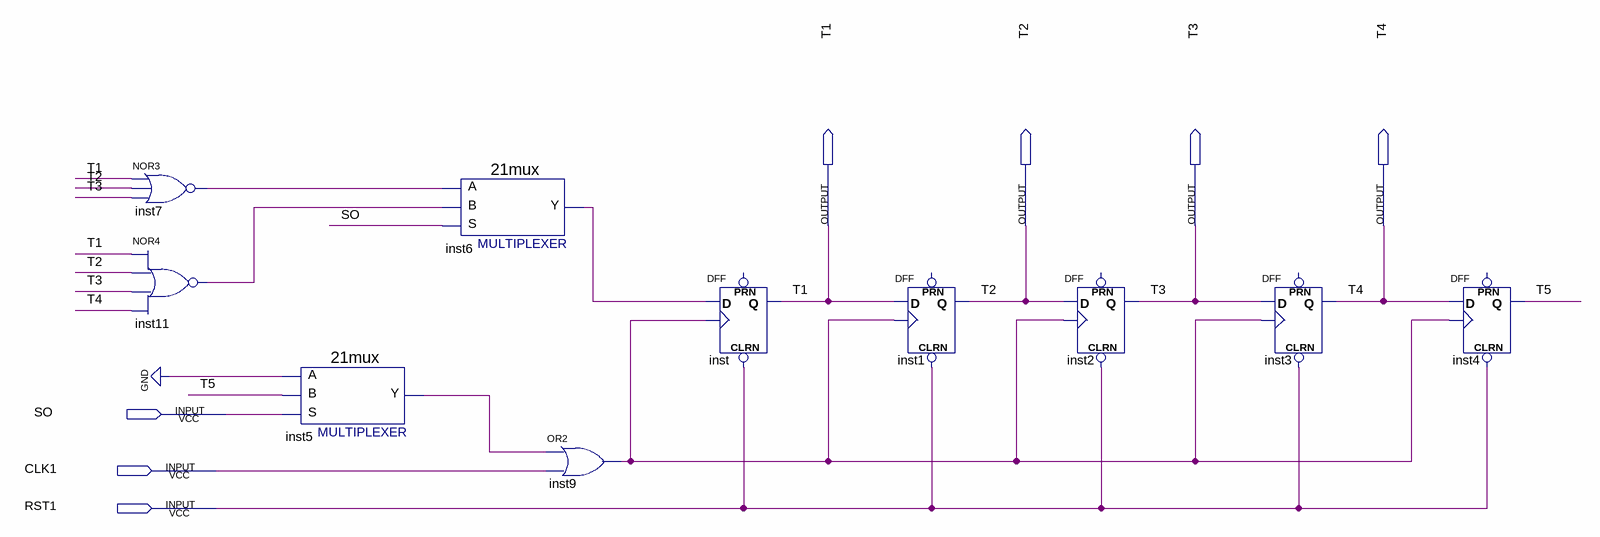
[diagram p0: schematic sheet]
// Quartus schematic Timing.bdf as structural Verilog: 10 symbols, 7 pins
module Timing (
  input  SO,
  input  CLK1,
  input  RST1,
  output T1,
  output T2,
  output T3,
  output T4
);

  wire inst5_y, inst6_y, inst7_out, inst9_out, inst11_out, T5;

  nor inst7 (inst7_out, T1, T2, T3);
  nor inst11 (inst11_out, T1, T2, T3, T4);
  \21mux  inst5 (.S(SO), .B(T5), .A(1'b0), .Y(inst5_y));
  \21mux  inst6 (.S(SO), .B(inst11_out), .A(inst7_out), .Y(inst6_y));
  or inst9 (inst9_out, inst5_y, CLK1);
  DFF inst (.CLRN(RST1), .CLK(inst9_out), .D(inst6_y), .Q(T1));  // open: PRN
  DFF inst1 (.CLRN(RST1), .CLK(inst9_out), .D(T1), .Q(T2));  // open: PRN
  DFF inst2 (.CLRN(RST1), .CLK(inst9_out), .D(T2), .Q(T3));  // open: PRN
  DFF inst3 (.CLRN(RST1), .CLK(inst9_out), .D(T3), .Q(T4));  // open: PRN
  DFF inst4 (.CLRN(RST1), .CLK(inst9_out), .D(T4), .Q(T5));  // open: PRN
endmodule
